# EAGLE design TelephoneConnect2_HoleAdjust (EAGLE 9.2.0)
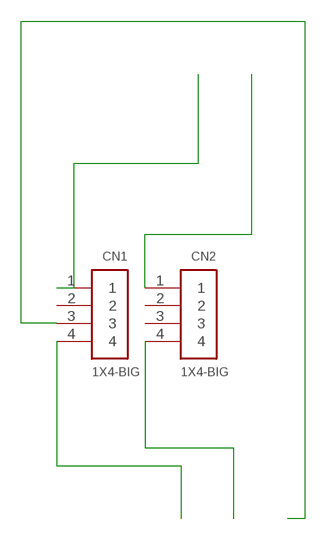
[diagram p0: schematic, sheet 1]

## Parts
CN1  1X4-BIG  [1X04-BIG]
CN2  1X4-BIG  [1X04-BIG]

## Nets
N$1: CN1.1
N$2: CN2.1
N$3: CN1.3
N$5: CN1.4
N$7: CN2.4
Unconnected: CN1.2 CN2.2 CN2.3

## Library data of the parts
CN1 CN2 = adafruit:1X4: 4-pin connector

## Net classes
0 default: width 1.016 mm, drill 0.076 mm

## Board
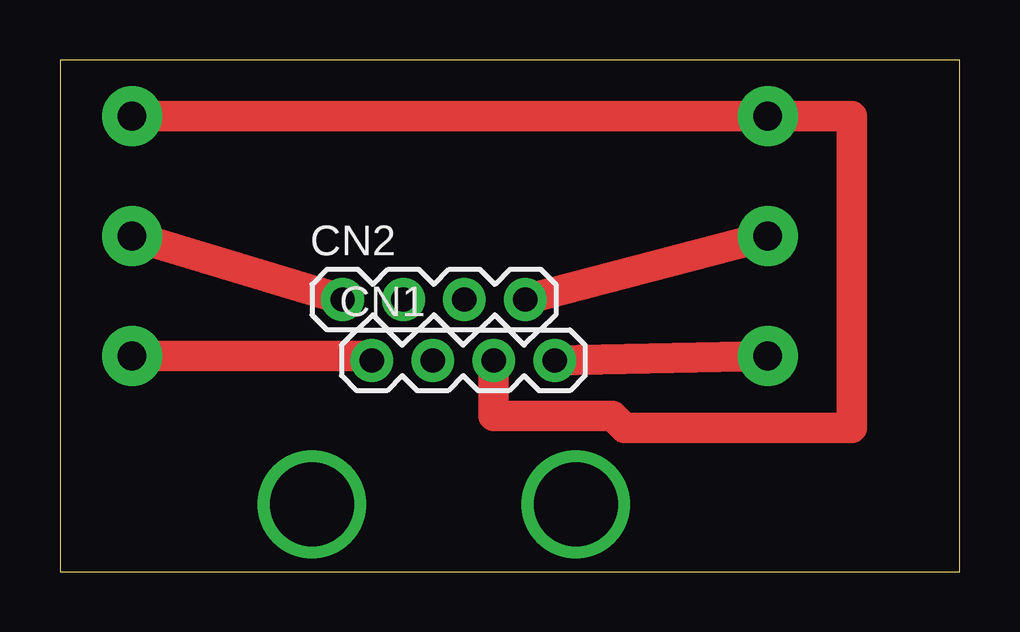
[diagram p1: board, top side]

Size 37.51 x 21.34 mm. Coordinates in mm from the lower left corner, seen from the top.
Outline: 0,0 37.51,0 37.51,21.34 0,21.34 0,0
Copper layers (1*16): Top 0.035mm / dielectric 1.5mm / Bottom 0.035mm
Design rules "OthermillDRC_1_32_v2": minimum track width 8mil, minimum drill 0.8mm, track to track 0.794003125mm, track to pad 0.794003125mm, pad to pad 0.794003125mm, via to via 0.794003125mm, smd to smd 0mil, copper to edge 0mil, drill to drill 1mil, minimum pad ring 10mil, minimum via ring 10mil, stop-mask expansion 1mil, vias tented up to drill 30mil, thermal gap 10mil

### Footprints (pad centres in the part's own frame; a part is rotated, then mirrored left to right if it is on the bottom)
1X04-BIG = drill 1.016 pad 1.778: 1 0,0; 2 2.54,0; 3 5.08,0; 4 7.62,0

### Placement (x,y rotation side)
CN1  13,8.81 0 top
CN2  11.78,11.35 0 top

### Tracks (layer width: path | path; a pad name or v marks a point on that pad's centre or on a via)
N$1  (via drill 1.2 pad 2.5)
  Top 1.27: CN1.1 12.81,9 v3,9
N$2  (via drill 1.2 pad 2.5)
  Top 1.27: CN2.1 v3,14
N$3  (via drill 1.2 pad 2.5)
  Top 1.27: 21.58,6.49 21.59,6.5 | 21.59,6.5 23.03,6.5 23.52,6 33,6 33,19 v29.5,19 v3,19 | CN1.3 18.08,6.5 21.59,6.5
N$5  (via drill 1.2 pad 2.5)
  Top 1.27: CN1.4 v29.5,9
N$7  (via drill 1.2 pad 2.5)
  Top 1.27: CN2.4 v29.5,14
N$8  (via drill 3.5 pad 1.3)
  other vias: 10.5,2.81
N$9  (via drill 3.5 pad 1.3)
  other vias: 21.5,2.81